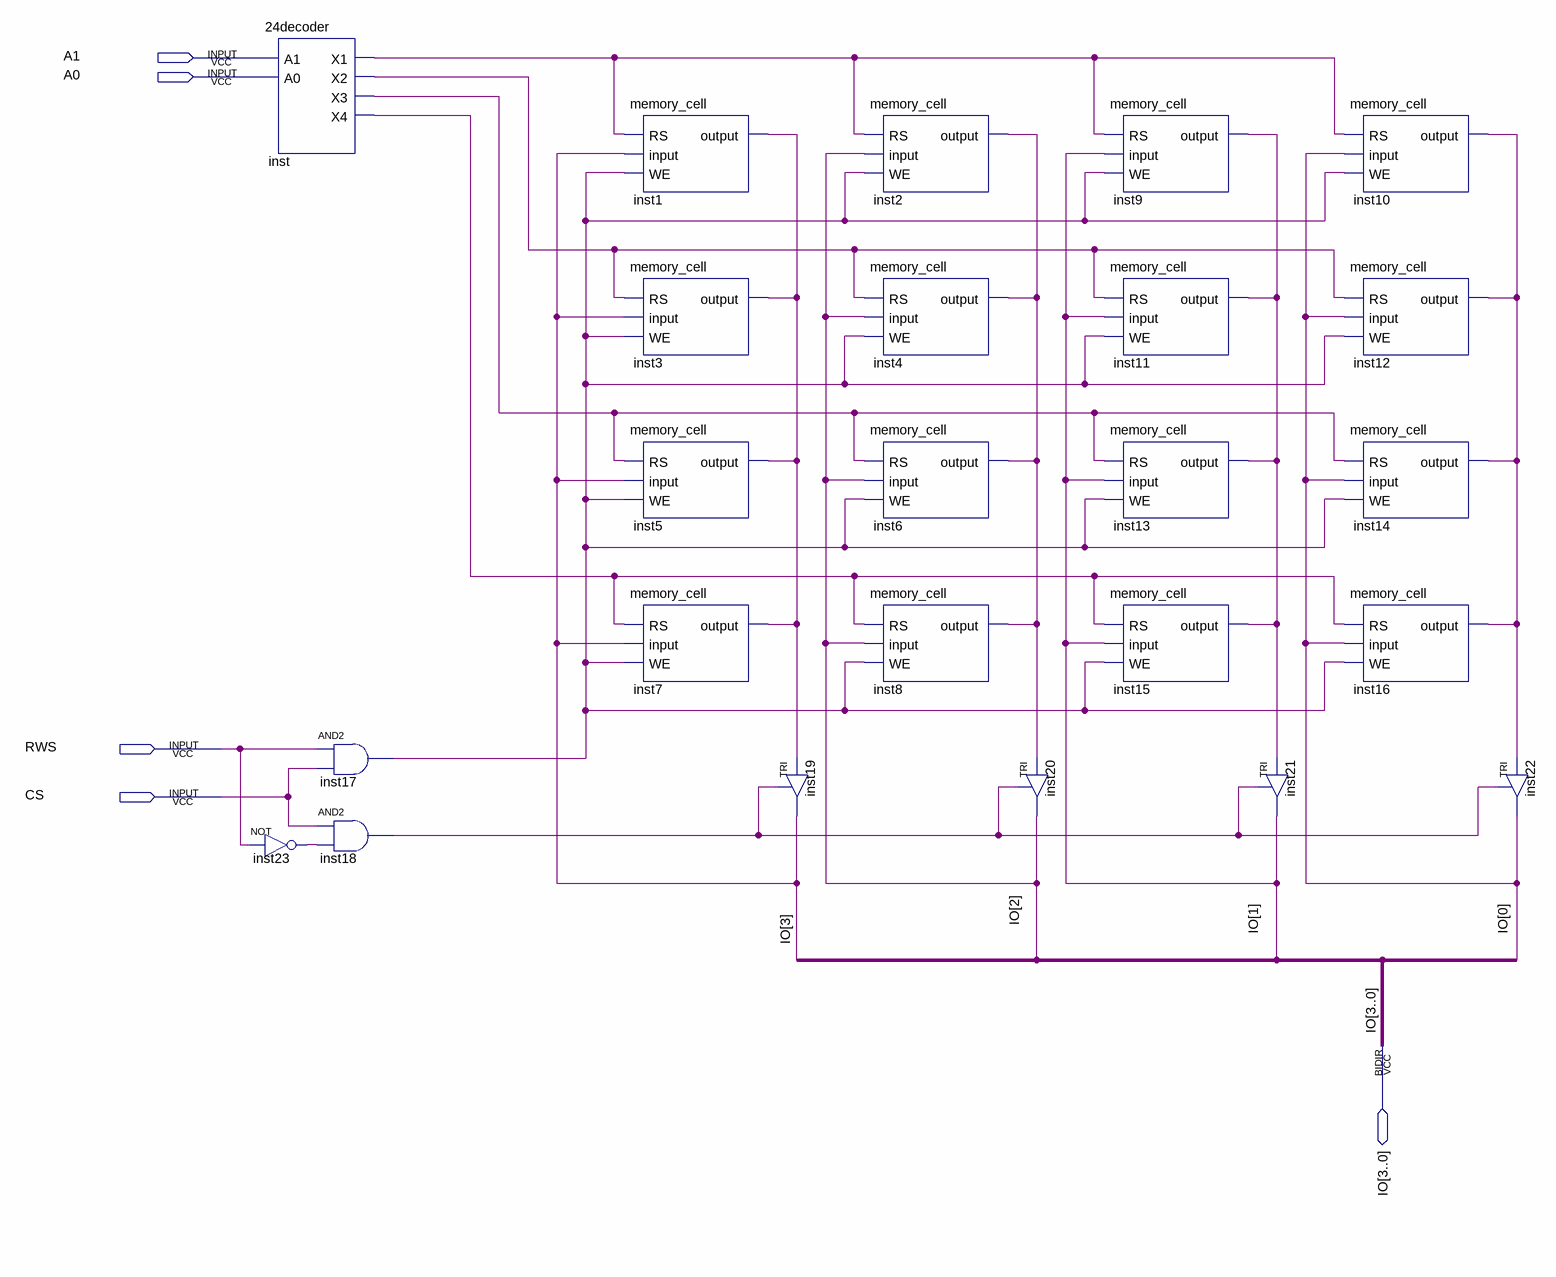
[diagram p0: schematic sheet]
// Quartus schematic 4x4ram.bdf as structural Verilog: 24 symbols, 5 pins
module \4x4ram  (
  input  A1,
  input  A0,
  input  RWS,
  input  CS,
  inout  [3:0] IO
);

  wire inst1_output, inst2_output, inst9_output, inst10_output, inst17_out, inst18_out, inst23_out, inst_x1,
       inst_x2, inst_x3, inst_x4;

  \24decoder  inst (.A1(A1), .A0(A0), .X1(inst_x1), .X2(inst_x2), .X3(inst_x3), .X4(inst_x4));
  not inst23 (inst23_out, RWS);
  and inst17 (inst17_out, RWS, CS);
  and inst18 (inst18_out, CS, inst23_out);
  memory_cell inst1 (.RS(inst_x1), .\input (IO[3]), .WE(inst17_out), .\output (inst1_output));
  memory_cell inst3 (.RS(inst_x2), .\input (IO[3]), .WE(inst17_out), .\output (inst1_output));
  memory_cell inst5 (.RS(inst_x3), .\input (IO[3]), .WE(inst17_out), .\output (inst1_output));
  memory_cell inst7 (.RS(inst_x4), .\input (IO[3]), .WE(inst17_out), .\output (inst1_output));
  TRI inst19 (.IN(inst1_output), .OE(inst18_out), .OUT(IO[3]));
  memory_cell inst2 (.RS(inst_x1), .\input (IO[2]), .WE(inst17_out), .\output (inst2_output));
  memory_cell inst4 (.RS(inst_x2), .\input (IO[2]), .WE(inst17_out), .\output (inst2_output));
  memory_cell inst6 (.RS(inst_x3), .\input (IO[2]), .WE(inst17_out), .\output (inst2_output));
  memory_cell inst8 (.RS(inst_x4), .\input (IO[2]), .WE(inst17_out), .\output (inst2_output));
  TRI inst20 (.IN(inst2_output), .OE(inst18_out), .OUT(IO[2]));
  memory_cell inst9 (.RS(inst_x1), .\input (IO[1]), .WE(inst17_out), .\output (inst9_output));
  memory_cell inst11 (.RS(inst_x2), .\input (IO[1]), .WE(inst17_out), .\output (inst9_output));
  memory_cell inst13 (.RS(inst_x3), .\input (IO[1]), .WE(inst17_out), .\output (inst9_output));
  memory_cell inst15 (.RS(inst_x4), .\input (IO[1]), .WE(inst17_out), .\output (inst9_output));
  TRI inst21 (.IN(inst9_output), .OE(inst18_out), .OUT(IO[1]));
  memory_cell inst10 (.RS(inst_x1), .\input (IO[0]), .WE(inst17_out), .\output (inst10_output));
  memory_cell inst12 (.RS(inst_x2), .\input (IO[0]), .WE(inst17_out), .\output (inst10_output));
  memory_cell inst14 (.RS(inst_x3), .\input (IO[0]), .WE(inst17_out), .\output (inst10_output));
  memory_cell inst16 (.RS(inst_x4), .\input (IO[0]), .WE(inst17_out), .\output (inst10_output));
  TRI inst22 (.IN(inst10_output), .OE(inst18_out), .OUT(IO[0]));
endmodule
